# Altium schematic sheet Sensors.SchDoc
size A4; SheetNumber: 4; SheetTotal: 5
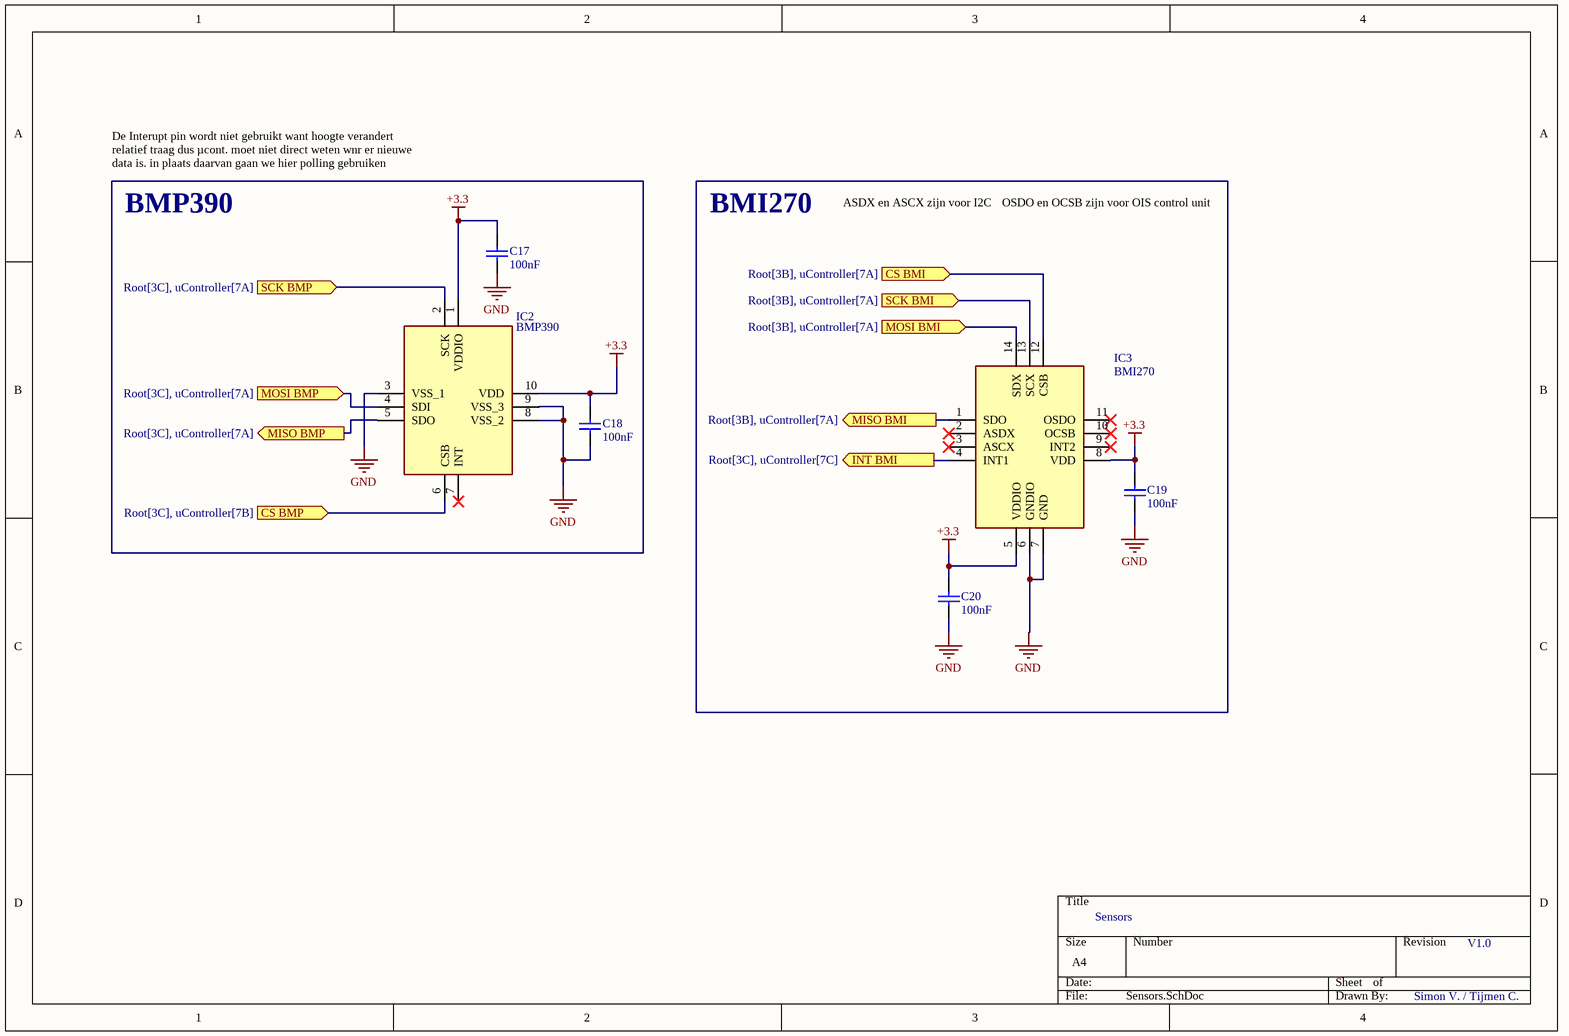
[diagram p0: Sensors.SchDoc]

## Parts
C17  100nF  [CAPC1608X92X38ML15T08]
C18  100nF  [CAPC1608X92X38ML15T08]
C19  100nF  [CAPC1608X92X38ML15T08]
C20  100nF  [CAPC1608X92X38ML15T08]
IC2  BMP390  [BMP390]
IC3  BMI270  [BMI270]

## Ports
CS BMI (in, see Root[3B], uController[7A]), CS BMP (in, see Root[3C], uController[7B]), INT BMI (out, see Root[3C], uController[7C]), MISO BMI (out, see Root[3B], uController[7A]), MISO BMP (out, see Root[3C], uController[7A]), MOSI BMI (in, see Root[3B], uController[7A]), MOSI BMP (in, see Root[3C], uController[7A]), SCK BMI (in, see Root[3B], uController[7A]), SCK BMP (in, see Root[3C], uController[7A])

## Nets
+3.3: C17.2 C18.2 C19.2 C20.2 IC2.1(VDDIO) IC2.10(VDD) IC3.5(VDDIO) IC3.8(VDD)
GND: C17.1 C18.1 C19.1 C20.1 IC2.3(VSS_1) IC2.8(VSS_2) IC2.9(VSS_3) IC3.6(GNDIO) IC3.7(GND)
CS BMI: IC3.12(CSB) ; port CS BMI
CS BMP: IC2.6(CSB) ; port CS BMP
INT BMI: IC3.4(INT1) ; port INT BMI
MISO BMI: IC3.1(SDO) ; port MISO BMI
MISO BMP: IC2.5(SDO) ; port MISO BMP
MOSI BMI: IC3.14(SDX) ; port MOSI BMI
MOSI BMP: IC2.4(SDI) ; port MOSI BMP
SCK BMI: IC3.13(SCX) ; port SCK BMI
SCK BMP: IC2.2(SCK) ; port SCK BMP

Not connected (* = marked no-connect by the designer): IC2 7(INT)*; IC3 2(ASDX)* 3(ASCX)* 9(INT2)* 10(OCSB)* 11(OSDO)*

## Notes on the sheet
- De Interupt pin wordt niet gebruikt want hoogte verandert relatief traag dus µcont. moet niet direct weten wnr er nieuwe data is. in plaats daarvan gaan we hier polling gebruiken
- BMP390
- BMI270
- ASDX en ASCX zijn voor I2C
- OSDO en OCSB zijn voor OIS control unit
- Sensors
- V1.0
- Simon V. / Tijmen C.

## Library data of the parts
C17-C20 = CMP-2006-01140-1: Part Number: VJ0603Y104MXXAC; Manufacturer: Vitramon
IC2 = BMP390: Integrated Circuit; Manufacturer_Name: BOSCH; Datasheet Link: https://www.bosch-sensortec.com/media/boschsensortec/downloads/datasheets/bst-bmp390-ds002.pdf; Height: 0.8mm; Manufacturer_Part_Number: BMP390; Mouser Part Number: 262-BMP390; Mouser Price/Stock: https://www.mouser.co.uk/ProductDetail/Bosch-Sensortec/BMP390?qs=QNEnbhJQKvYQVfvRMgo2YA%3D%3D; Arrow Part Number: BMP390; Arrow Price/Stock: https://www.arrow.com/en/products/bmp390/bosch-sensortec?utm_currency=USD&region=nac
IC3 = BMI270: Integrated Circuit; Manufacturer_Name: BOSCH; Datasheet Link: https://www.bosch-sensortec.com/media/boschsensortec/downloads/datasheets/bst-bmi270-ds000.pdf; Height: 0.87mm; Manufacturer_Part_Number: BMI270; Mouser Part Number: 262-BMI270; Mouser Price/Stock: https://www.mouser.co.uk/ProductDetail/Bosch-Sensortec/BMI270?qs=u16ybLDytRYIj%252BjQEee88A%3D%3D; Arrow Part Number: BMI270; Arrow Price/Stock: https://www.arrow.com/en/products/bmi270/bosch-sensortec?utm_currency=USD&region=europe